# EAGLE design BeagleboneCape-RevC (EAGLE 7.1.0)
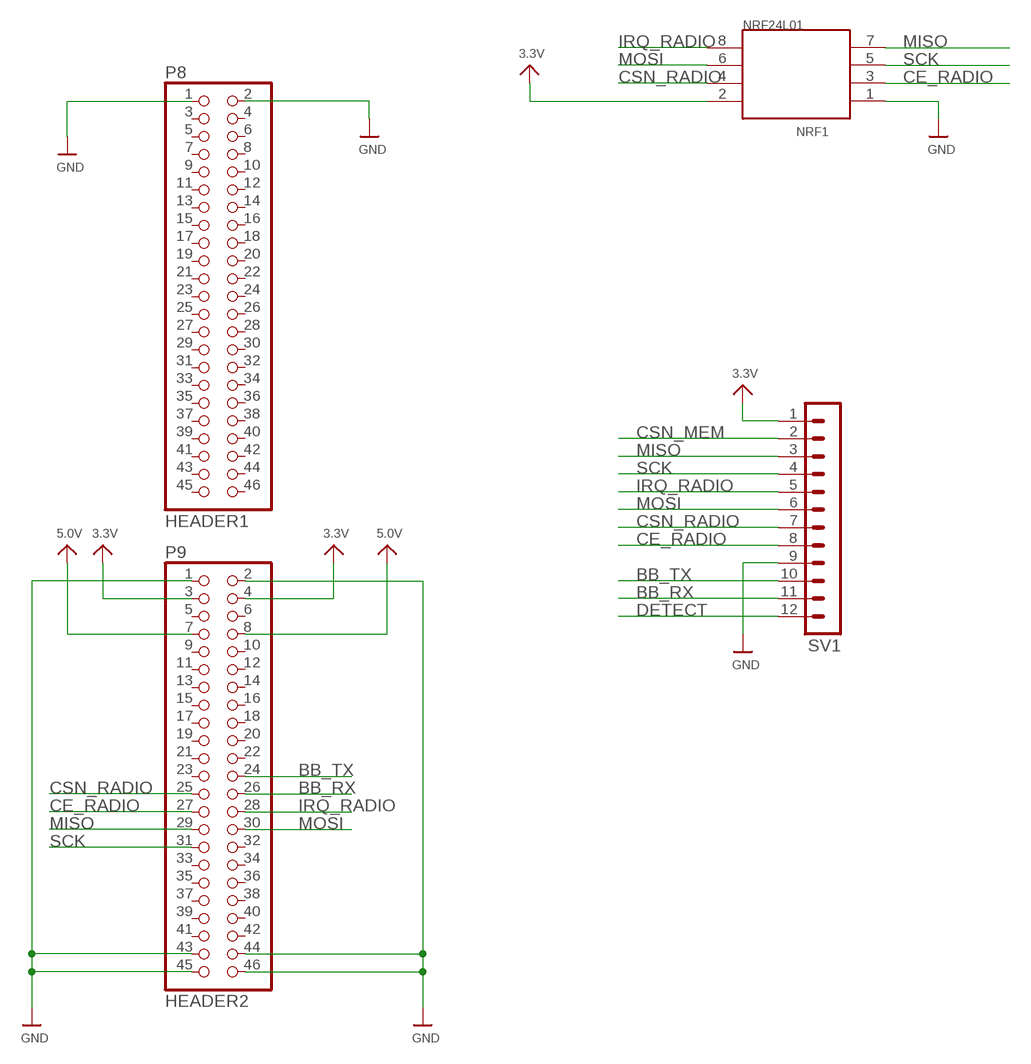
[diagram p0: schematic, sheet 1]

## Parts
NRF24L01  NRF1  2X4SMDHEADER  [TSM-110-XX-XXX-DV]
P8  HEADER1  PINHD-2X24  [2X23]
P9  HEADER2  PINHD-2X24  [2X23]
SV1  MA12-1  [MA12-1]

## Nets
3.3V: NRF24L01.2 P9.3 P9.4 SV1.1
5.0V: P9.7 P9.8
BB_RX: P9.26 SV1.11
BB_TX: P9.24 SV1.10
CE_RADIO: NRF24L01.3 P9.27 SV1.8
CSN_MEM: SV1.2
CSN_RADIO: NRF24L01.4 P9.25 SV1.7
DETECT: SV1.12
GND: NRF24L01.1 P8.1 P8.2 P9.1 P9.2 P9.43 P9.44 P9.45 P9.46 SV1.9
IRQ_RADIO: NRF24L01.8 P9.28 SV1.5
MISO: NRF24L01.7 P9.29 SV1.3
MOSI: NRF24L01.6 P9.30 SV1.6
SCK: NRF24L01.5 P9.31 SV1.4
Unconnected: P8.3 P8.4 P8.5 P8.6 P8.7 P8.8 P8.9 P8.10 P8.11 P8.12 P8.13 P8.14 P8.15 P8.16 P8.17 P8.18 P8.19 P8.20 P8.21 P8.22 P8.23 P8.24 P8.25 P8.26 P8.27 P8.28 P8.29 P8.30 P8.31 P8.32 P8.33 P8.34 P8.35 P8.36 P8.37 P8.38 P8.39 P8.40 P8.41 P8.42 P8.43 P8.44 P8.45 P8.46 P9.5 P9.6 P9.9 P9.10 P9.11 P9.12 P9.13 P9.14 P9.15 P9.16 P9.17 P9.18 P9.19 P9.20 P9.21 P9.22 P9.23 P9.32 P9.33 P9.34 P9.35 P9.36 P9.37 P9.38 P9.39 P9.40 P9.41 P9.42

## Library data of the parts
NRF24L01 = Header:2X4SMDHEADER
P8 P9 = 2X23Header:PINHD-2X24: PIN HEADER
SV1 = con-lstb:MA12-1: PIN HEADER; OC_FARNELL: unknown; OC_NEWARK: unknown

## Board
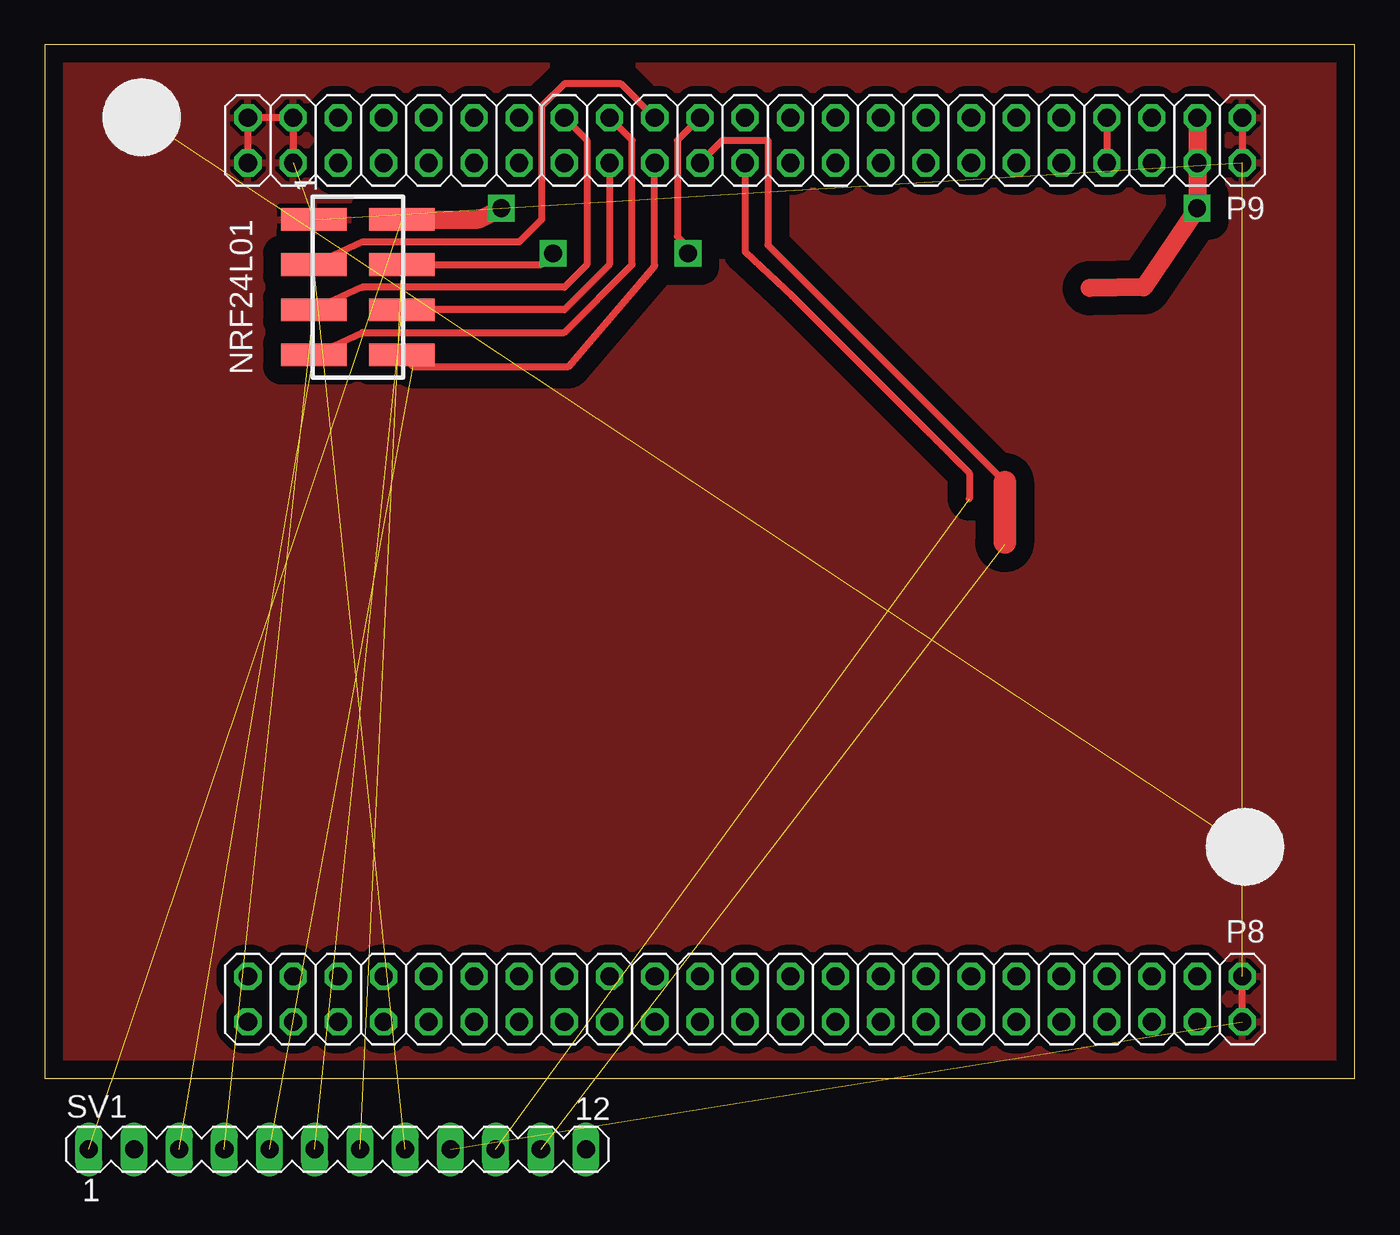
[diagram p1: board, top side]
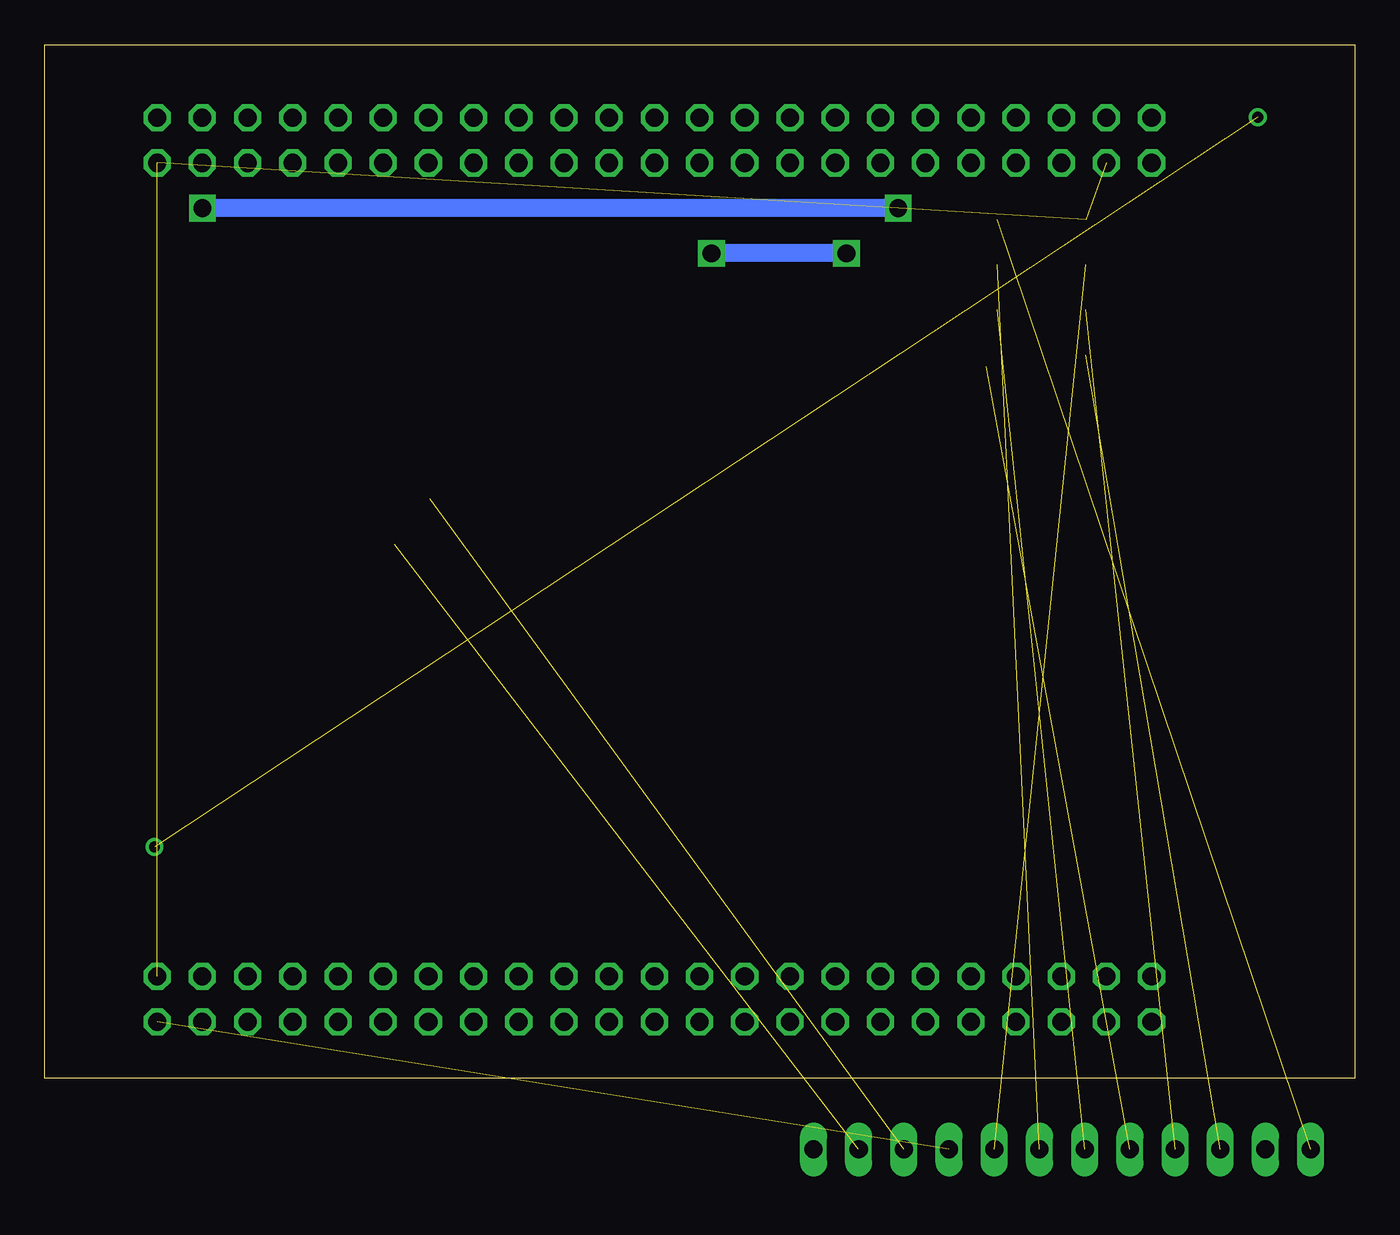
[diagram p2: board, bottom side, seen from below]

Size 73.64 x 58.09 mm. Coordinates in mm from the lower left corner, seen from the top.
Outline: 0,0 73.64,0 73.64,58.09 0,58.09 0,0
Copper layers (1*16): Top 0.035mm / dielectric 1.5mm / Bottom 0.035mm
Design rules "default": minimum track width 10mil, minimum drill 24mil, track to track 8mil, track to pad 8mil, pad to pad 8mil, via to via 8mil, smd to smd 8mil, copper to edge 40mil, drill to drill 8mil, minimum pad ring 10mil, minimum via ring 8mil, stop-mask expansion 4mil, vias tented up to drill 0mil, thermal gap 10mil

### Footprints (pad centres in the part's own frame; a part is rotated, then mirrored left to right if it is on the bottom)
TSM-110-XX-XXX-DV = smd 1.27 x 3.683: 1 -3.81,-2.731; 2 -3.81,2.223; 3 -1.27,-2.731; 4 -1.27,2.223; 5 1.27,-2.731; 6 1.27,2.223; 7 3.81,-2.731; 8 3.81,2.223
2X23 = drill 1.016 octagon: 1 -27.94,-1.27; 2 -27.94,1.27; 3 -25.4,-1.27; 4 -25.4,1.27; 5 -22.86,-1.27; 6 -22.86,1.27; 7 -20.32,-1.27; 8 -20.32,1.27; 9 -17.78,-1.27; 10 -17.78,1.27; 11 -15.24,-1.27; 12 -15.24,1.27; 13 -12.7,-1.27; 14 -12.7,1.27; 15 -10.16,-1.27; 16 -10.16,1.27; 17 -7.62,-1.27; 18 -7.62,1.27; 19 -5.08,-1.27; 20 -5.08,1.27; 21 -2.54,-1.27; 22 -2.54,1.27; 23 0,-1.27; 24 0,1.27; 25 2.54,-1.27; 26 2.54,1.27; 27 5.08,-1.27; 28 5.08,1.27; 29 7.62,-1.27; 30 7.62,1.27; 31 10.16,-1.27; 32 10.16,1.27; 33 12.7,-1.27; 34 12.7,1.27; 35 15.24,-1.27; 36 15.24,1.27; 37 17.78,-1.27; 38 17.78,1.27; 39 20.32,-1.27; 40 20.32,1.27; 41 22.86,-1.27; 42 22.86,1.27; 43 25.4,-1.27; 44 25.4,1.27; 45 27.94,-1.27; 46 27.94,1.27
MA12-1 = drill 1.016 long: 1 -13.97,0; 2 -11.43,0; 3 -8.89,0; 4 -6.35,0; 5 -3.81,0; 6 -1.27,0; 7 1.27,0; 8 3.81,0; 9 6.35,0; 10 8.89,0; 11 11.43,0; 12 13.97,0

### Placement (x,y rotation side)
NRF24L01  17.86,44.45 270 top
P8  39.37,4.45 180 top
P9  39.37,52.7 180 top
SV1  16.46,-4 0 top  (outside the outline)

### Tracks (layer width: path | path; a pad name or v marks a point on that pad's centre or on a via)
3.3V  (via drill 1)  (1 unrouted)
  Top 1.016: P9.3 P9.4 v64.77,48.9 61.77,44.45 58.73,44.41 | NRF24L01.2 24.4,48.26 v25.67,48.9
  Bottom 1.016: v25.67,48.9 v64.77,48.9
5.0V
  Top 0.406: P9.7 P9.8
BB_RX  (1 unrouted)
  Top 0.406: P9.26 38.1,52.7 40.64,52.7 40.64,46.82 53.96,33.5 | 53.96,30 53.96,30.09
  Top 1.27: 53.96,33.5 53.96,30.09
BB_TX  (1 unrouted)
  Top 0.406: 39.24,51.44 P9.24 39.37,46.44 42.02,43.94 51.96,34 51.96,32.55
CE_RADIO  (1 unrouted)
  Top 0.406: P9.27 32.38,55.88 29.21,55.88 27.94,54.61 27.94,48.26 26.67,46.99 17.86,46.99 NRF24L01.3
CSN_RADIO  (via drill 1)  (1 unrouted)
  Top 0.406: P9.25 35.56,52.7 35.56,47.3 36.16,46.7 v36.16,46.35 | NRF24L01.4 27.94,45.72 v28.57,46.35
  Bottom 1.016: v28.57,46.35 v36.16,46.35
DNC  (via drill 0.6)  (1 unrouted)
  other vias: 5.46,54 67.46,13
GND  (4 unrouted)
  Top 0.406: P9.1 P9.2 | P9.46 P9.45 P9.43 P9.44 | P8.2 P8.1
  pour Top (isolate 1.016): 0,0 0,58.42 72.39,58.42 72.39,0
IRQ_RADIO  (1 unrouted)
  Top 0.406: NRF24L01.8 20.72,40 29.46,40 34.26,45.6 34.29,45.67 P9.28
MISO  (1 unrouted)
  Top 0.406: NRF24L01.7 17.86,41.91 29.21,41.91 33.02,45.72 33.02,52.7 P9.29
MOSI  (1 unrouted)
  Top 0.406: P9.30 31.75,45.72 29.21,43.18 NRF24L01.6
SCK  (1 unrouted)
  Top 0.406: P9.31 30.48,52.7 30.48,45.72 29.21,44.45 17.86,44.45 NRF24L01.5

### Text on the board
_tNames: Smart Home BB-WIRELESS | 2015 Rev. B